# Altium schematic sheet MCU.SchDoc
size A4
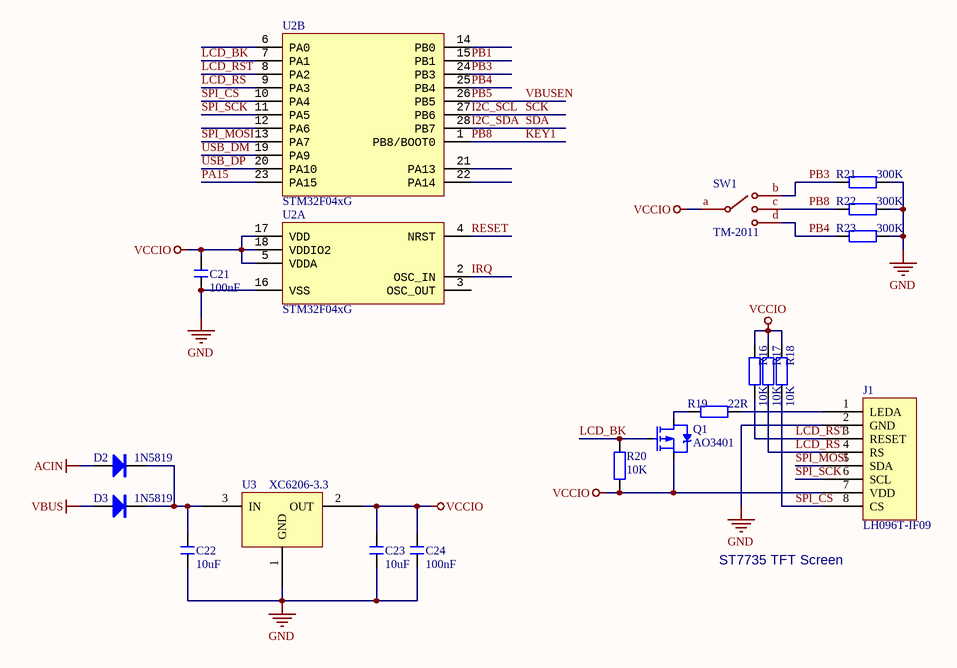
[diagram p0: MCU.SchDoc]

## Parts
C21  100nF  [C 0603_L]
C22  10uF  [C 0603_L]
C23  10uF  [C 0603_L]
C24  100nF  [C 0603_L]
D2  1N5819  [SOD-123]
D3  1N5819  [SOD-123]
J1  LH096T-IF09  [LH096T-IF09]
Q1  AO3401  [SOT23-3]
R16  10K  [R 0603_L]
R17  10K  [R 0603_L]
R18  10K  [R 0603_L]
R19  22R  [R 0603_L]
R20  10K  [R 0603_L]
R21  300K  [R 0603_L]
R22  300K  [R 0603_L]
R23  300K  [R 0603_L]
SW1  TM-2011  [TM-2011]
U2  STM32F04xG  [QFN_P0.5_28_NOPAD]  (parts A,B of 2)
U3  XC6206-3.3  [SOT23-3]

## Nets
ACIN: D2.1(A)
GND: C21.1 C22.2 C23.2 C24.2 J1.2(GND) R21.2 R22.2 R23.2 U2.16(VSS) U3.1(GND)
VBUS: D3.1(A)
VCCIO: C21.2 C23.1 C24.1 J1.7(VDD) Q1.2(S) R16.2 R17.2 R18.2 R20.1 SW1.a U2.5(VDDA) U2.17(VDD) U2.18(VDDIO2) U3.2(OUT)
I2C_SCL: U2.27(PB6)  [also labelled SCK]
I2C_SDA: U2.28(PB7)  [also labelled SDA]
IRQ: U2.2(OSC_IN)
KEY1: R22.1 SW1.c U2.1(PB8/BOOT0)  [also labelled PB8]
LCD_BK: Q1.1(G) R20.2 U2.7(PA1)
LCD_RS: J1.4(RS) R17.1 U2.9(PA3)
LCD_RST: J1.3(RESET) R16.1 U2.8(PA2)
PA15: U2.23(PA15)
PB1: U2.15(PB1)
PB3: R21.1 SW1.b U2.24(PB3)
PB4: R23.1 SW1.d U2.25(PB4)
PB5: U2.26(PB5)  [also labelled VBUSEN]
RESET: U2.4(NRST)
SPI_CS: J1.8(CS) R18.1 U2.10(PA4)
SPI_MOSI: J1.5(SDA) U2.13(PA7)
SPI_SCK: J1.6(SCL) U2.11(PA5)
USB_DM: U2.19(PA9)
USB_DP: U2.20(PA10)
NetC22_1: C22.1 D2.2(K) D3.2(K) U3.3(IN)
NetJ1_1: J1.1(LEDA) R19.2
NetQ1_3: Q1.3(D) R19.1

Not connected (* = marked no-connect by the designer): U2 3(OSC_OUT) 6(PA0) 12(PA6) 14(PB0) 21(PA13) 22(PA14)

## Notes on the sheet
- (near J1) ST7735 TFT Screen

## Library data of the parts
C21-C24 = C: 无极性贴片电容; 版权归属: 源创客; BOM名称: 无极性贴片电容; 学习资源: www.ooocke.com
D2 D3 = 1N4007: 整流二极管; 版权归属: 源创客; BOM名称: 整流二极管; 学习资源: www.ooocke.com
R16-R23 = R: 贴片电阻; 版权归属: 源创客; BOM名称: 贴片电阻; 学习资源: www.ooocke.com
U2 = STM32F04xG: MCU